# EAGLE design CYD-pcb-v4-buffer-Castellated  (EAGLE 9.6.2)
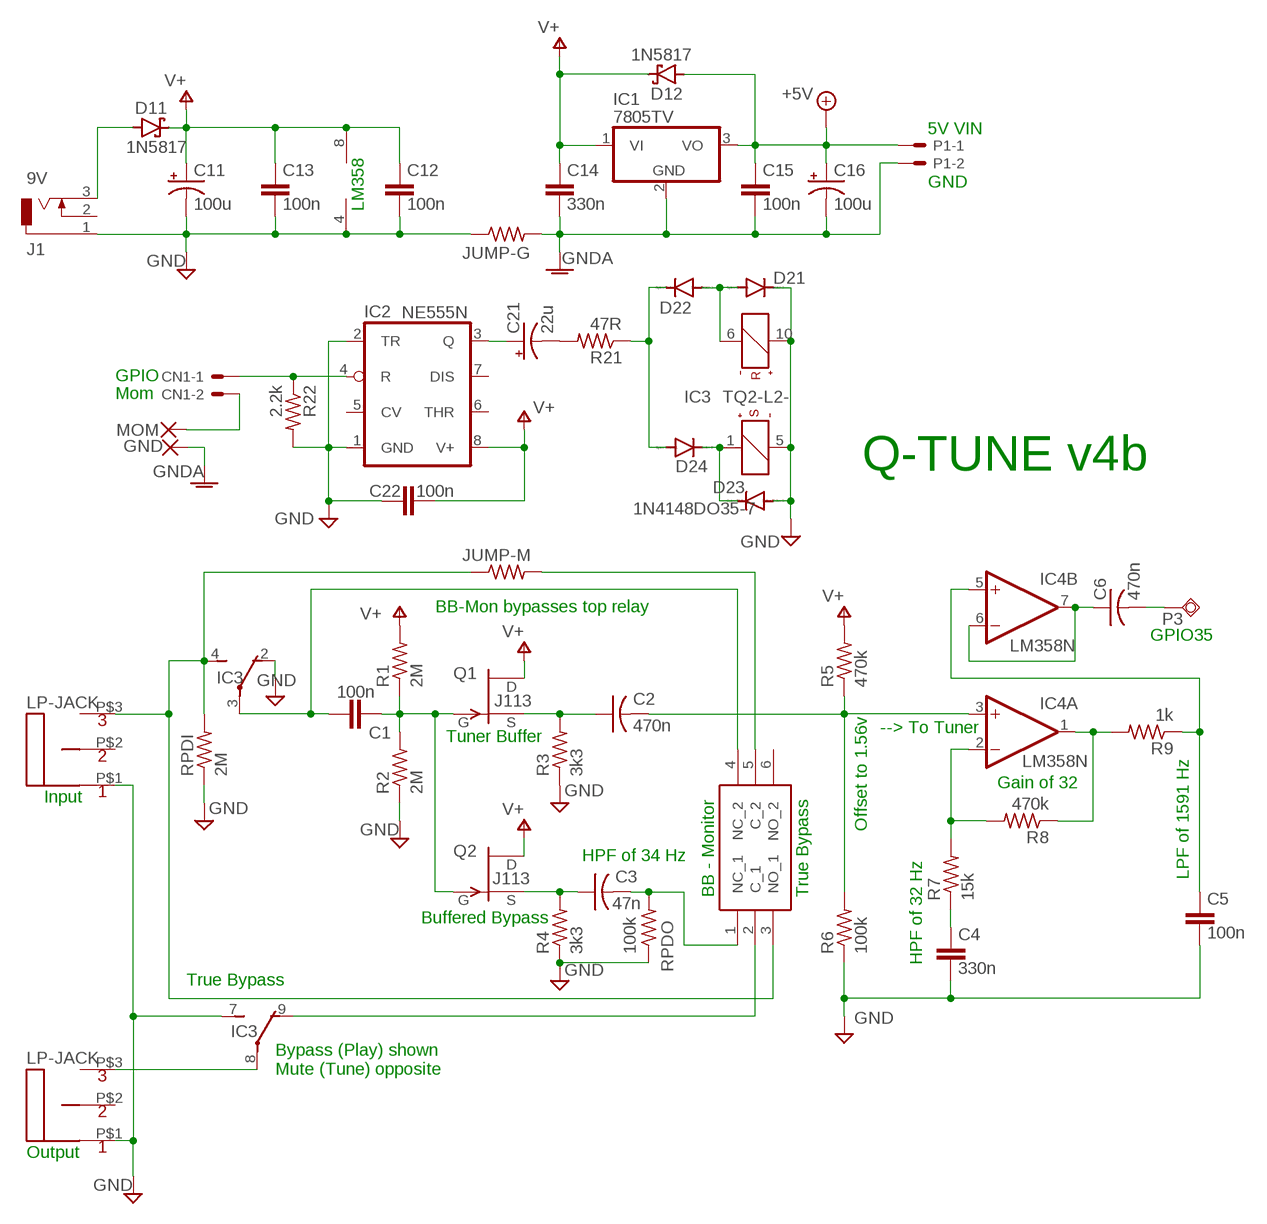
[diagram p0: schematic, sheet 1]

## Parts
C1  100n  C-EU050-024X044  [C050-024X044]
C2  470n  C-US050-035X075  [C050-035X075]
C3  47n  C-US050-035X075  [C050-035X075]
C4  330n  C-EU050-024X044  [C050-024X044]
C5  100n  C-EU050-024X044  [C050-024X044]
C6  470n  C-US050-035X075  [C050-035X075]
C11  100u  CPOL-USE2.5-6  [E2,5-6]
C12  100n  C-EU050-024X044  [C050-024X044]
C13  100n  C-EU050-024X044  [C050-024X044]
C14  330n  C-EU050-024X044  [C050-024X044]
C15  100n  C-EU050-024X044  [C050-024X044]
C16  100u  CPOL-USE2.5-6  [E2,5-6]
C21  22u  CPOL-USE2.5-6  [E2,5-6]
C22  100n  C-EU050-024X044  [C050-024X044]
CN1  22-23-2021  [22-23-2021]
D11  1N5817  1N5819-B  [DO41-7.6]
D12  1N5817  1N5819-B  [DO41-7.6]
D21  1N4148DO35-7  [DO35-7]
D22  1N4148DO35-7  [DO35-7]
D23  1N4148DO35-7  [DO35-7]
D24  1N4148DO35-7  [DO35-7]
GND  WIREPAD1,6/0,9  [1,6/0,9]
IC1  7805TV  [TO220V]
IC2  NE555N  [DIL08]
IC3  TQ2-L2-  [TQ2]
IC4  LM358N  [DIL08]
INPUTJACK  LPJACK-DEVICE  [LPJACK-FOOTPRINT]
J1  9V  DCJ0303  [DCJ0303]
JUMP-G  *  R-US_0207/7  [0207/7]
JUMP-M  1  R-US_0207/7  [0207/7]
MOM  WIREPAD1,6/0,9  [1,6/0,9]
OUTPUTJACK  LPJACK-DEVICE  [LPJACK-FOOTPRINT]
P1  22-23-2021  [22-23-2021]
P3  TPSQPAD1-13Y  [P1-13Y]
Q1  J113  2N5484  [TO92-]
Q2  J113  2N5484  [TO92-]
R1  2M  R-US_0207/7  [0207/7]
R2  2M  R-US_0207/7  [0207/7]
R3  3k3  R-US_0207/7  [0207/7]
R4  3k3  R-US_0207/7  [0207/7]
R5  470k  R-US_0207/7  [0207/7]
R6  100k  R-US_0207/7  [0207/7]
R7  15k  R-US_0207/7  [0207/7]
R8  470k  R-US_0207/7  [0207/7]
R9  1k  R-US_0207/7  [0207/7]
R21  47R  R-US_0207/7  [0207/7]
R22  2.2k  R-US_0207/7  [0207/7]
RPDI  2M  R-US_0207/7  [0207/7]
RPDO  100k  R-US_0207/7  [0207/7]
SW1  JS202011AQN  [JS202011AQN]

## Nets
+5V: C15.1 C16.+ D12.A IC1.3(VO) P1.1
GND: C4.2 C5.2 C11.- C12.2 C13.2 C22.1 D21.C D23.A IC2.1(GND) IC2.2(TR) IC3.2(1:O) IC3.5(S:-) IC3.7(2:S) IC3.10(R:+) IC4.4(P:V-) INPUTJACK.P$1 J1.1 JUMP-G.1 OUTPUTJACK.P$1 R2.1 R3.1 R4.1 R6.1 R22.2 RPDI.1 RPDO.1
GNDA: C14.2 C15.2 C16.- GND.1(P) IC1.2(GND) JUMP-G.2 P1.2
N$1: CN1.1 IC2.4(R) R22.1
N$2: C3.2 RPDO.2 SW1.1(NC_1)
N$4: C2.1 Q1.2(S) R3.2
N$5: C2.2 IC4.3(A:+IN) R5.1 R6.2
N$6: IC4.2(A:-IN) R7.2 R8.2
N$7: IC4.1(A:OUT) R8.1 R9.2
N$8: D22.C D24.A R21.1
N$9: C6.1 IC4.6(B:-IN) IC4.7(B:OUT)
N$10: CN1.2 MOM.1(P)
N$11: D11.A J1.3
N$12: C4.1 R7.1
N$13: D23.C D24.C IC3.1(S:+)
N$14: D21.A D22.A IC3.6(R:-)
N$15: C1.2 IC3.3(1:P) SW1.4(NC_2)
N$16: C21.+ IC2.3(Q)
N$17: C21.- R21.2
N$18: C5.1 IC4.5(B:+IN) R9.1
N$19: C1.1 Q1.1(G) Q2.1(G) R1.1 R2.2
N$20: C3.1 Q2.2(S) R4.2
N$21: IC3.8(2:P) OUTPUTJACK.P$3
N$22: IC3.9(2:O) SW1.2(C_1)
N$23: JUMP-M.2 SW1.5(C_2)
N$24: C6.2 P3.TP
N$25: IC3.4(1:S) INPUTJACK.P$3 JUMP-M.1 RPDI.2 SW1.3(NO_1)
V+: C11.+ C12.1 C13.1 C14.1 C22.2 D11.C D12.C IC1.1(VI) IC2.8(V+) IC4.8(P:V+) Q1.3(D) Q2.3(D) R1.2 R5.2
Unconnected: IC2.5(CV) IC2.6(THR) IC2.7(DIS) INPUTJACK.P$2 J1.2 OUTPUTJACK.P$2 SW1.6(NO_2)

## Notes on the sheet
- 5V VIN
- GND
- LM358
- GPIO
- Mom
- Q-TUNE v4b
- BB-Mon bypasses top relay
- GPIO35
- --> To Tuner
- Tuner Buffer
- Gain of 32
- Input
- Offset to 1.56v
- HPF of 34 Hz
- LPF of 1591 Hz
- BB - Monitor | True Bypass
- Buffered Bypass
- HPF of 32 Hz
- True Bypass
- Bypass (Play) shown
  Mute (Tune) opposite
- Output

## Library data of the parts
C1 C4 C5 C12-C15 C22 = rcl:C-EU: CAPACITOR, European symbol; SPICEPREFIX: C
C2 C3 C6 = rcl:C-US: CAPACITOR, American symbol; SPICEPREFIX: C
C11 C16 C21 = rcl:CPOL-US: POLARIZED CAPACITOR, American symbol; SPICEPREFIX: C
CN1 P1 = con-molex:22-23-2021: .100" (2.54mm) Center Header - 2 Pin; MF: MOLEX; MPN: 22-23-2021; OC_FARNELL: 1462926; OC_NEWARK: 25C3832
D11 D12 = diode:1N581*: 1.0A SCHOTTKY BARRIER RECTIFIER Source: http://www.diodes.com/datasheets/ds23001.pdf
D21-D24 = diode:1N4148: DIODE high speed (Philips)
GND MOM = wirepad:WIREPAD: Wire PAD connect wire on PCB
IC1 = linear:78*: Positive VOLTAGE REGULATOR Source: http://cache.national.com/ds/LM/LM78L05.pdf http://www.fairchildsemi.com/ds/LM/LM7805.pdf
IC2 = 7805-no-hole:*555: TIMER
IC3 = relay:TQ2?-L2-*: LOW PROFILE 2 FORM C RELAY NAiS 2 coil latching Source: http://www.mew-europe.com/.. en_ds_61020_0001.pdf Source: http://www.mew-europe.com/.. en_ds_61020_0002.pdf; MF: AROMAT/ MATSUSHITA; MPN: TQ2-L2-9V; OC_FARNELL: 1217662; OC_NEWARK: 64K3196
IC4 = 7805-no-hole:LM358: OP AMP also LM158; LM258; LM2904 Source: http://cache.national.com/ds/LM/LM158.pdf
INPUTJACK OUTPUTJACK = StereoAudioJack:LPJACK-DEVICE
J1 = con-jack:DCJ0303: DC POWER JACK Source: DCJ0303.pdf; OC_FARNELL: unknown; OC_NEWARK: unknown
JUMP-G JUMP-M R1-R9 R21 R22 RPDI RPDO = rcl:R-US_: RESISTOR, American symbol; SPICEPREFIX: R
P3 = testpad:TPSQ: Test pad
Q1 Q2 = transistor-fet:?548*: N-Channel JFETs Source: VISHAY 2N5484.pdf Compatible: TO92 2N5245 J304 J305 U310 J308 J309 J310 TO72 2N4416 2N4416A 2N3823 2N4351 3N169 3N170 3N171 MFE3002 TO18 2N3796 2N3797 MFE825 Source: Motorola European Master Guide Pacge 3-59
SW1 = SamacSys_Parts:JS202011AQN: SWITCH SLIDE SPDT 300MA 6V Source: Datasheet <https://www.ckswitches.com/media/1422/js.pdf>; ARROW_PART_NUMBER: JS202011AQN; ARROW_PRICE-STOCK: https://www.arrow.com/en/products/js202011aqn/ck?region=europe; DESCRIPTION: SWITCH SLIDE SPDT 300MA 6V; HEIGHT: 3mm; MANUFACTURER_NAME: C & K COMPONENTS; MANUFACTURER_PART_NUMBER: JS202011AQN; MOUSER_PART_NUMBER: 611-JS202011AQN; MOUSER_PRICE-STOCK: https://www.mouser.co.uk/ProductDetail/CK/JS202011AQN?qs=LgMIjt8LuD%252Bmsz6wAeWWtQ%3D%3D

## Board
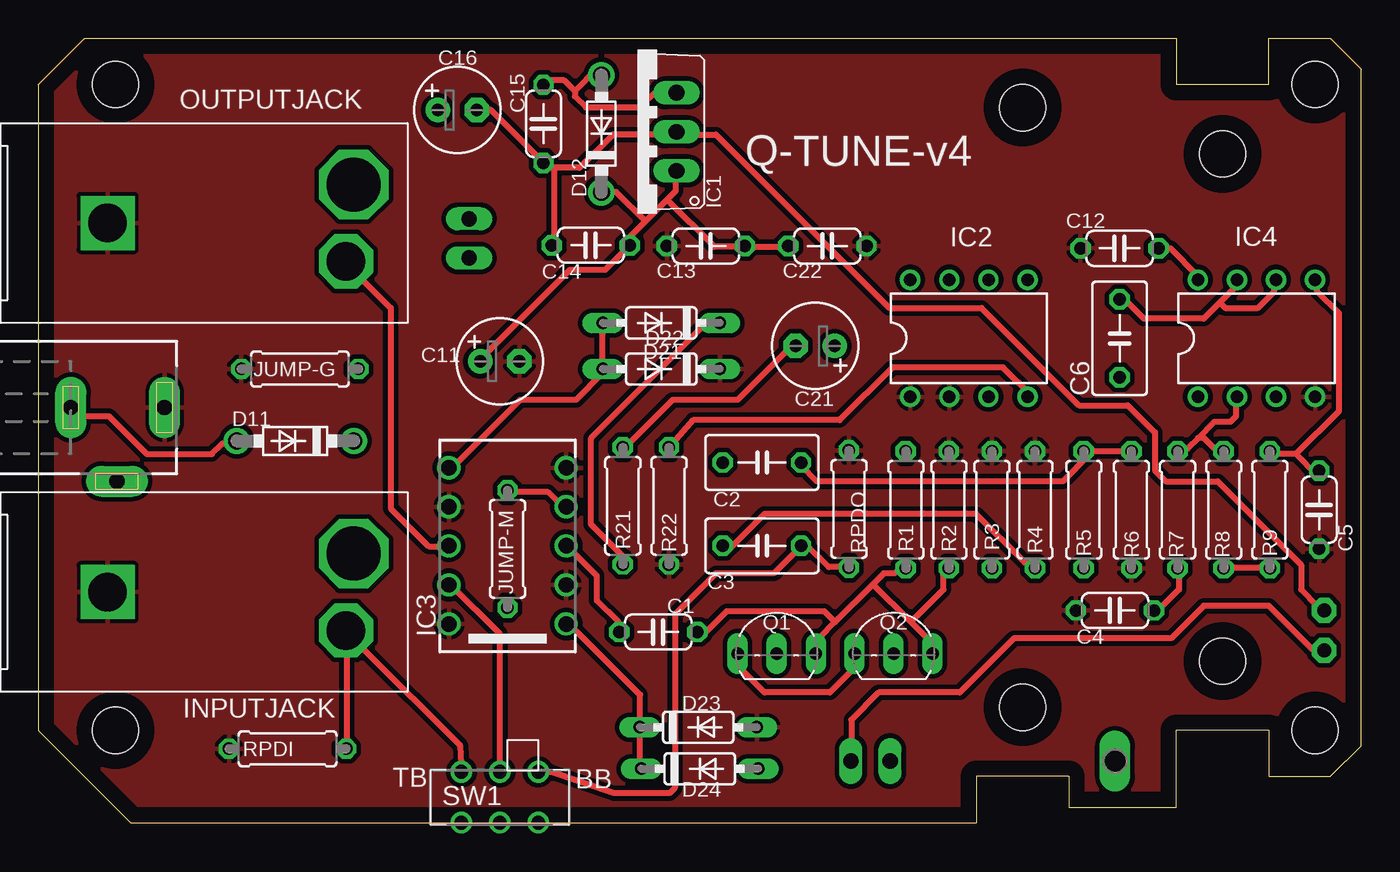
[diagram p1: board, top side]
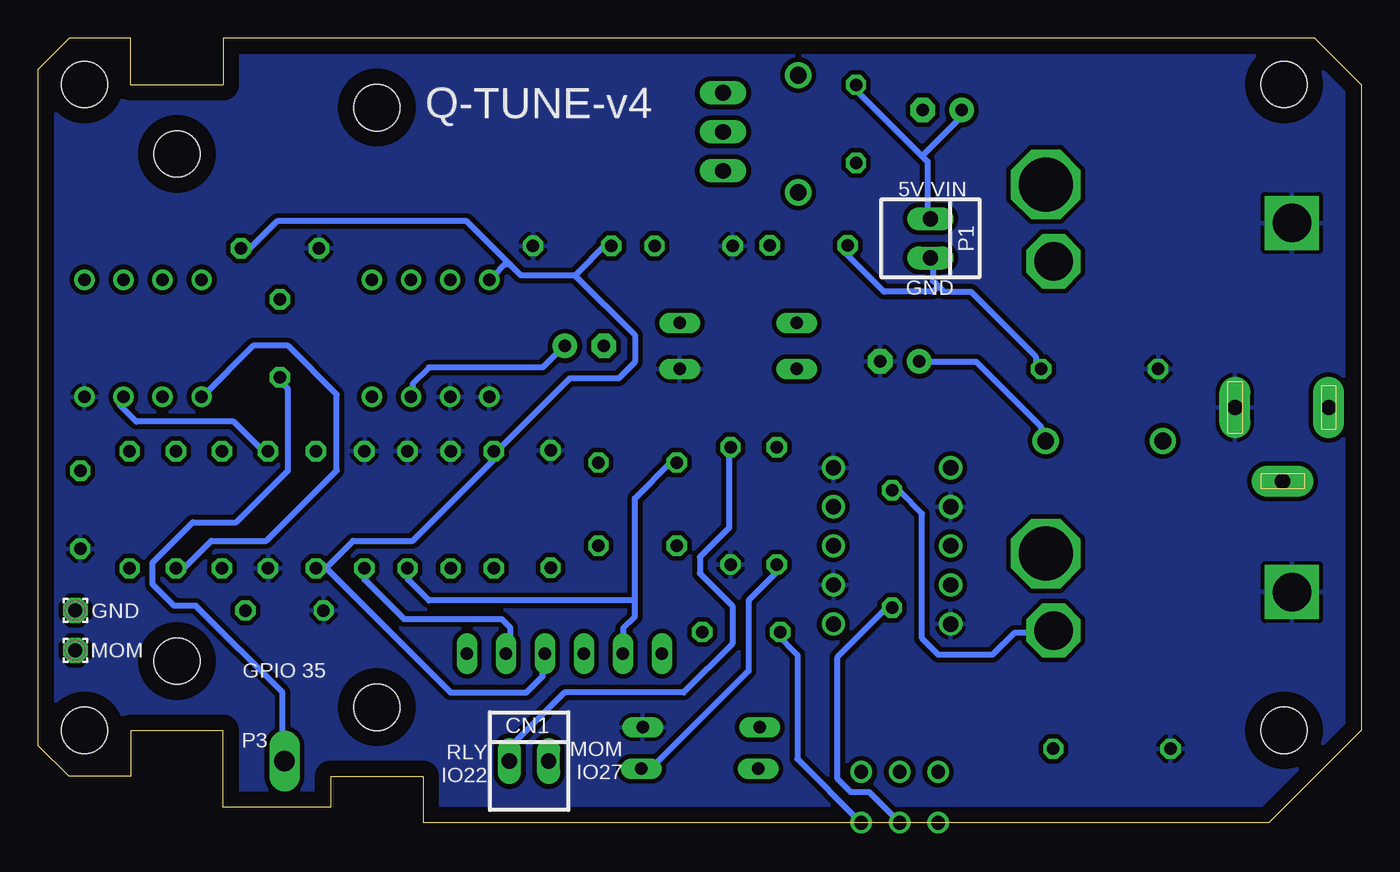
[diagram p2: board, bottom side, seen from below]

Size 86 x 51 mm. Coordinates in mm from the lower left corner, seen from the top.
Outline: 0,48 0,6 6,0 61,0 61,3 67,3 67,1 74,1 74,6 80,6 80,3 84,3 86,5 86,49 84,51 80,51 80,48 74,48 74,51 3,51 0,48
Copper layers (1*16): Top 0.035mm / dielectric 1.5mm / Bottom 0.035mm
Design rules "default *": minimum track width 0.4mm, minimum drill 0.35mm, track to track 12mil, track to pad 12mil, pad to pad 10mil, via to via 12mil, smd to smd 6mil, copper to edge 40mil, drill to drill 6mil, minimum pad ring 10mil, minimum via ring 8mil, stop-mask expansion 4mil, vias tented up to drill 0mil, thermal gap 10mil
Holes 3 mm at 5,48 5,6 83,48 83,6 64,7.5 64,46.5 77,10.5 77,43.5

### Footprints (pad centres in the part's own frame; a part is rotated, then mirrored left to right if it is on the bottom)
C050-024X044 = drill 0.813 octagon: 1 -2.54,0; 2 2.54,0
C050-035X075 = drill 0.813 octagon: 1 -2.54,0; 2 2.54,0
E2,5-6 = drill 0.813 pad 1.6: + -1.27,0 | drill 0.813 pad 1.6 octagon: - 1.27,0
22-23-2021 = drill 1 long: 1 -1.27,0; 2 1.27,0
DO41-7.6 = drill 1.1 pad 1.7: A 3.81,0; C -3.81,0
DO35-7 = drill 0.813 long: A 3.81,0; C -3.81,0
1,6/0,9 = drill 0.914 pad 1.6 octagon: 1 0,0
TO220V = drill 1.016 long: 1 -2.54,-2.54; 2 0,-2.54; 3 2.54,-2.54
DIL08 = drill 0.813 pad 1.27: 1 -3.81,-3.81; 2 -1.27,-3.81; 3 1.27,-3.81; 4 3.81,-3.81; 5 3.81,3.81; 6 1.27,3.81; 7 -1.27,3.81; 8 -3.81,3.81
TQ2 = drill 1: 1 -5.08,-3.81; 2 -2.54,-3.81; 3 0,-3.81; 4 2.54,-3.81; 5 5.08,-3.81; 6 5.08,3.81; 7 2.54,3.81; 8 0,3.81; 9 -2.54,3.81; 10 -5.08,3.81
LPJACK-FOOTPRINT = drill 2.5 square: P$1 -0.5,0 | drill 3.5 octagon: P$2 15.5,2.5 | drill 2.5 octagon: P$3 15,-2.5
DCJ0303 = drill 1 pad 2 long: 1 0,3.1; 2 4.8,0; 3 0,-3
0207/7 = drill 0.813 octagon: 1 -3.81,0; 2 3.81,0
P1-13Y = drill 1.321 pad 1.905 long: TP 0,0
TO92- = drill 0.813 long: 1 2.54,0; 2 0,0; 3 -2.54,0
JS202011AQN = drill 0.9 pad 1.4: 1 -2.5,-1.425; 2 0,-1.425; 3 2.5,-1.425; 4 -2.5,1.875; 5 0,1.875; 6 2.5,1.875

### Placement (x,y rotation side)
C1  40.3,12.4 180 top
C2  47.05,23.42 0 top
C3  47.05,18 0 top
C4  70,13.8 180 top
C5  83.28,20.34 270 top
C6  70.3,31.5 270 top
C11  30,30 0 top
C12  70.3,37.35 180 top
C13  43.4,37.5 180 top
C14  35.92,37.55 180 top
C15  32.84,45.45 270 top
C16  27.24,46.34 0 top
C21  50.5,31 180 top
C22  51.3,37.5 180 top
CN1  54.1,4 0 bottom
D11  16.7,24.82 180 top
D12  36.6,44.8 90 top
D21  40.5,29.5 180 top
D22  40.5,32.5 180 top
D23  42.9,6.2 0 top
D24  43,3.5 0 top
GND  83.6,13.8 270 bottom
IC1  38.95,44.93 90 top
IC2  60.5,31.5 0 top
IC3  30.5,18 90 top
IC4  79.2,31.5 0 top
INPUTJACK  5,15 0 top
J1  5.1,27 270 top
JUMP-G  17,29.5 0 top
JUMP-M  30.5,17.8 270 top
MOM  83.6,11.2 270 bottom
OUTPUTJACK  5,39 0 top
P1  28,38 270 bottom
P3  70,4 0 top
Q1  48,11 0 top
Q2  55.6,11 0 top
R1  56.4,20.34 90 top
R2  59.2,20.34 270 top
R3  62,20.34 270 top
R4  64.8,20.34 270 top
R5  67.97,20.34 270 top
R6  71.07,20.34 90 top
R7  74.07,20.34 90 top
R8  77.07,20.34 90 top
R9  80.07,20.34 270 top
R21  38,20.6 90 top
R22  41,20.6 270 top
RPDI  16.2,4.8 0 top
RPDO  52.7,20.4 270 top
SW1  30,1.88 180 top

### Tracks (layer width: path | path; a pad name or v marks a point on that pad's centre or on a via)
+5V
  Top 0.4: 34.89,47.57 34.18,48.28 33.13,48.28 C15.1 | 34.89,47.57 36.3,48.98 36.65,48.63 D12.A | 34.89,47.57 34.89,47.22 35.59,46.52 39.12,46.52 40.17,47.57 41.23,47.57 IC1.3
  Bottom 0.4: 28.54,43.34 33.13,47.93 C15.1 | 28.54,43.34 28.19,42.99 28.19,39.47 P1.1 | 28.54,43.34 26.08,45.81 26.08,46.16 C16.+
GND
  pour Top (isolate 0.305): 3,51 74,51 74,48 80,48 80,51 84,51 86,49 86,5 84,3 80,3 80,6 74,6 74,0.5 5.5,0.5 0,6 0,48
  pour Bottom (isolate 0.305): 3,51 74,51 74,48 80,48 80,51 84,51 86,49 86,5 81.5,0.5 0,0.5 0,48
GNDA
  Top 0.4: 32.42,43.34 29.4,46.36 28.53,46.36 C16.- | 32.42,43.34 32.77,42.99 C15.2 32.42,43.34 | 33.53,42.44 32.63,43.34 32.42,43.34 | GND.1 83.52,14.1 83.17,14.1 82.11,15.15 82.11,16.77 76.68,22.2 73.3,22.2 72.59,22.91 72.59,25.37 70.83,27.14 67.66,27.14 61.32,33.48 55.33,33.48 44.05,44.76 41.58,44.76 IC1.2 41.23,44.76 37.35,44.76 35.18,42.58 33.53,42.58 33.53,42.44 | 33.53,42.44 33.53,37.71 33.48,37.71 C14.2
  Bottom 0.4: 27.49,34.89 27.84,35.24 27.84,36.65 P1.2 | 27.49,34.89 27.14,34.53 25.37,34.53 21.14,30.31 21.14,29.6 JUMP-G.2 | 27.49,34.89 27.84,34.53 31.01,34.53 33.48,37 33.48,37.35 C14.2
N$1
  Top 0.4: R22.1 42.57,26.17 52.1,26.17 55.53,29.6 62.73,29.6 64.49,27.84 IC2.4
  Bottom 0.4: CN1.1 55.33,4.23 55.33,4.93 51.8,8.46 44.05,8.46 40.88,11.63 40.88,14.1 42.99,16.21 42.99,17.27 41.08,19.18 41.08,23.76 40.88,23.96 40.88,24.32 R22.1
N$2
  Top 0.4: RPDO.2 52.7,16.61 51.4,16.61 50.04,17.97 49.69,17.97 C3.2 49.59,17.97 47.82,16.21 44.05,16.21 41.38,13.54 41.38,2.26 41.03,1.91 37.44,1.91 33.28,3.3 SW1.1
N$4
  Bottom 0.4: C2.1 44.89,23.42 47.22,21.09 47.22,14.45 | 47.22,14.45 47.22,13.39 47.98,12.63 47.98,11.02 Q1.2 | 47.22,14.45 60.61,14.45 61.97,15.81 61.97,16.5 R3.2
N$5
  Top 0.4: C2.2 49.59,23.21 50.6,22.2 66.6,22.2 68.37,23.96 68.01,24.32 R5.1 68.01,23.96 68.2,24.16 R6.2
  Bottom 0.4: IC4.3 80.7,27.49 80.7,27.14 79.64,26.08 73.3,26.08 71.19,23.96 R6.2
N$6
  Top 0.4: 75.41,25.02 74.71,24.32 74.36,24.32 R7.2 | 75.41,25.02 75.77,25.02 76.82,23.96 R8.2 | 75.41,25.02 76.47,26.08 77.53,26.08 77.88,26.43 77.88,27.49 IC4.2
N$7
  Top 0.4: R8.1 77.08,16.5 77.14,16.56 80,16.56 R9.2
  Bottom 0.4: R8.1 76.56,16.54 74.77,18.32 71.19,18.32 66.6,22.91 66.6,27.84 69.78,31.01 72.04,31.01 75.33,27.72 IC4.1
N$8
  Top 0.4: D22.C 44.05,32.42 43.34,32.42 35.95,25.02 35.95,19.38 38.41,16.91 38.06,16.56 R21.1
  Bottom 0.4: D24.A 46.52,3.52 46.16,3.52 39.82,9.87 39.82,14.45 37.71,16.56 R21.1
N$9
  Top 0.4: 76.82,33.83 78.23,35.24 IC4.7 | 76.82,33.83 75.77,32.77 71.89,32.77 70.83,33.83 70.48,33.83 C6.1 | 76.82,33.83 77.18,33.48 79.29,33.48 80.35,34.53 80.35,35.24 IC4.6
N$10
  Top 0.4: CN1.2 52.86,4.23 52.86,6.7 54.62,8.46 59.91,8.46 63.43,11.98 73.65,11.98 75.77,14.1 80,14.1 82.81,11.28 83.52,11.28 MOM.1
N$11
  Top 0.4: D11.A 12.69,24.67 11.98,24.67 11.28,23.96 7.05,23.96 4.58,26.43 2.47,26.43 2.11,26.78 J1.3
N$12
  Top 0.4: C4.1 72.8,13.8 74.15,15.15 74.15,16.45 R7.1
N$13
  Top 0.4: D24.C 39.12,3.52 39.12,5.99 D23.C 39.12,6.34 39.12,8.31 34.51,12.92 IC3.1
N$14
  Top 0.4: D22.A 36.65,32.42 36.65,29.6 D21.A 36.65,29.25 36.65,29.19 34.95,27.49 31.31,27.49 26.9,23.08 IC3.6
N$15
  Top 0.4: C1.2 37.71,12.69 37.71,13.04 36.3,14.45 36.3,16.06 34.33,18.03 IC3.3
  Bottom 0.4: SW1.4 32.51,0 36.65,4.14 36.65,10.92 38.06,12.33 C1.2
N$16
  Bottom 0.4: IC2.3 61.67,27.84 61.67,28.54 60.61,29.6 53.21,29.6 51.8,31.01 C21.+
N$17
  Top 0.4: R21.2 38.06,24.67 38.41,24.67 41.23,27.49 45.46,27.49 48.63,30.66 48.63,31.01 48.98,31.01 C21.-
N$18
  Top 0.4: 81.76,23.96 80.35,23.96 R9.1 | 81.76,23.96 83.17,22.55 C5.1 | 81.76,23.96 84.58,26.78 84.58,33.13 83.17,34.53 83.17,35.24 IC4.5
N$19
  Top 0.4: 54.27,15.51 54.97,16.21 55.68,16.21 56.03,16.56 56.38,16.56 R1.1 | 54.27,15.51 51.8,13.04 | 51.8,13.04 50.75,11.98 50.75,11.28 Q1.1 | 54.27,15.51 56.74,13.04 | 56.74,13.04 57.79,11.98 57.79,11.28 Q2.1 | 51.8,13.04 51.1,13.74 44.76,13.74 43.34,12.33 42.99,12.33 C1.1 | 56.74,13.04 58.85,15.15 58.85,16.21 R2.2
N$20
  Top 0.4: C3.1 44.76,17.97 45.11,17.97 47.22,20.09 60.97,20.09 64.14,16.91 64.84,16.91 64.84,16.56 R4.2
  Bottom 0.4: R4.2 64.79,15.81 62.23,13.24 55.88,13.24 55.33,12.69 55.33,11.28 Q2.2
N$21
  Top 0.4: IC3.8 26.43,17.97 25.37,17.97 22.91,20.44 22.91,33.48 20.09,36.3 OUTPUTJACK.P$3
N$22
  Top 0.4: SW1.2 30,12.29 26.78,15.51 IC3.9
N$23
  Bottom 0.4: JUMP-M.2 30.82,13.99 34.03,10.77 34.03,2.84 33.19,2 32,2 SW1.5
N$24
  Bottom 0.4: C6.2 70.13,28.9 70.13,28.54 69.78,28.19 69.78,22.91 73.15,19.53 75.97,19.53 78.58,16.91 78.58,15.51 77.18,14.1 75.77,14.1 70.13,8.46 70.13,4.23 P3.TP
N$25
  Top 0.4: JUMP-M.1 30.66,21.5 33.13,21.5 34.18,20.44 IC3.4 | 20.09,11.28 20.09,12.33 INPUTJACK.P$3 20.03,12.08 | 20.03,12.08 20.03,5.34 20.09,5.29 20.09,4.93 RPDI.2 | 20.09,11.28 21.14,11.28 27.44,4.98 27.5,3.8 SW1.3 | 20.09,11.28 20.03,12.08
  Bottom 0.4: JUMP-M.1 30.31,21.5 29.95,21.5 28.54,20.09 28.54,11.98 27.49,10.92 23.96,10.92 22.55,12.33 20.09,12.33 INPUTJACK.P$3
V+
  Top 0.4: Q1.3 45.81,10.92 45.81,9.87 47.22,8.46 51.45,8.46 52.86,9.87 52.86,10.92 Q2.3 | 40.88,40.53 41.44,41.08 41.44,42.34 IC1.1 | 40.88,40.53 39.47,39.12 | 39.47,39.12 38.41,38.06 38.41,37.71 C14.1 | 39.47,39.12 37.57,41.02 36.63,41.02 D12.C | IC4.8 75.39,35.56 73.6,37.35 C12.1 | C22.2 48.84,37.45 46.02,37.45 C13.1 45.9,37.45 43.95,37.45 40.88,40.53 | C14.1 | C14.1 36.85,35.95 34.53,35.95 28.9,30.31 C11.+
  Bottom 0.4: 67.31,16.56 65.55,18.32 61.67,18.32 56.38,23.61 56.38,23.96 R1.2 56.38,24.32 56.03,24.32 51.45,28.9 48.28,28.9 47.22,29.95 47.22,31.72 51.1,35.59 | 67.31,16.56 67.66,16.91 68.01,16.91 68.01,16.56 R5.2 | 67.31,16.56 59.2,8.46 54.27,8.46 53.21,9.52 53.21,10.92 Q2.3 | C11.+ 28.54,29.95 25.02,29.95 20.79,25.73 20.79,25.02 D11.C | 55.33,36.3 55.68,36.3 56.38,35.59 IC2.8 | 55.33,36.3 54.62,35.59 51.1,35.59 | 51.1,35.59 48.98,37.71 C22.2 | 55.33,36.3 58.15,39.12 70.48,39.12 72.24,37.35 72.59,37.35 C12.1

### Text on the board
tNames: Q-TUNE-v4 | INPUTJACK | TB | BB
bNames: Q-TUNE-v4 | 5V VIN | GND | GPIO 35 | MOM / IO27 | RLY / IO22